# Altium schematic sheet 485Driver_MAX3462.SchDoc
size A4
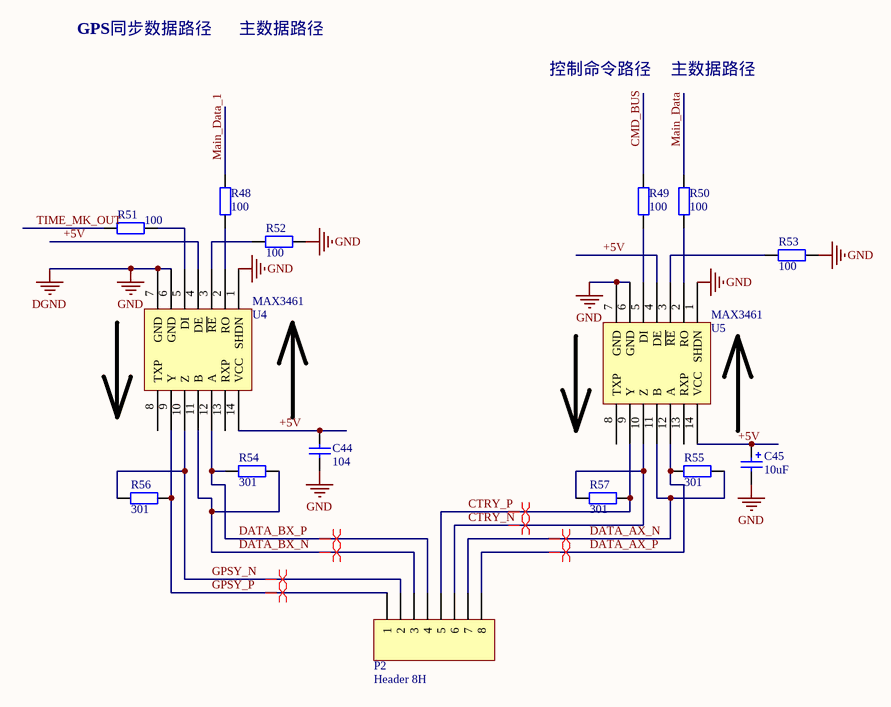
[diagram p0: 485Driver_MAX3462.SchDoc]

## Parts
C44  104  [0805C]
C45  10uF  [C68uF]
P2  Header 8H  [HDR1X8H]
R48  100  [0805R]
R49  100  [0805R]
R50  100  [0805R]
R51  100  [0805R]
R52  100  [0805R]
R53  100  [0805R]
R54  301  [0805R]
R55  301  [0805R]
R56  301  [0805R]
R57  301  [0805R]
U4  MAX3461  [SOP14]
U5  MAX3461  [SOP14]

## Nets
DGND: C44.1 C45.2 R52.2 R53.2 U4.1(SHDN) U4.6(GND) U4.7(GND) U5.1(SHDN) U5.6(GND) U5.7(GND)  [also labelled GND]
+5V: C44.2 C45.1 U4.4(DE) U4.14(VCC) U5.4(DE) U5.14(VCC)
CMD_BUS: R49.1
CTRY_N: P2.6 R57.2 U5.10(Z)
CTRY_P: P2.5 R57.1 U5.9(Y)
DATA_AX_N: P2.7 R55.1 U5.11(B)
DATA_AX_P: P2.8 R55.2 U5.12(A)
DATA_BX_N: P2.3 R54.1 U4.11(B)
DATA_BX_P: P2.4 R54.2 U4.12(A)
GPSY_N: P2.2 R56.2 U4.10(Z)
GPSY_P: P2.1 R56.1 U4.9(Y)
Main_Data: R50.1
Main_Data_1: R48.1
TIME_MK_OUT: R51.2
NetR48_2: R48.2 U4.2(RO)
NetR49_2: R49.2 U5.5(DI)
NetR50_2: R50.2 U5.2(RO)
NetR51_1: R51.1 U4.5(DI)
NetR52_1: R52.1 U4.3(~{RE})
NetR53_1: R53.1 U5.3(~{RE})

Not connected (* = marked no-connect by the designer): U4 8(TXP) 13(RXP); U5 8(TXP) 13(RXP)

## Layout directives
differential pair: CTRY_N, CTRY_P, DATA_AX_N, DATA_AX_P, DATA_BX_N, DATA_BX_P, GPSY_N, GPSY_P

## Notes on the sheet
- GPS同步数据路径
- 主数据路径
- 控制命令路径

## Library data of the parts
C44 = Cap: Capacitor; Value: 100nF; Published: 8-Jun-2000; LatestRevisionDate: 17-Jul-2002; LatestRevisionNote: Re-released for DXP Platform.; PackageReference: RAD-0.3; Publisher: Altium Limited
C45 = Cap Pol2: Polarized Capacitor (Axial); Value: 100pF; Published: 8-Jun-2000; LatestRevisionDate: 17-Jul-2002; LatestRevisionNote: Re-released for DXP Platform.; PackageReference: POLAR0.8; Publisher: Altium Limited
P2 = Header 8H: Header, 8-Pin, Right Angle; LatestRevisionDate: 17-Jul-2002; LatestRevisionNote: Re-released for DXP Platform.; Publisher: Altium Limited
R48-R57 = Res2: Resistor; Value: 1K; Published: 8-Jun-2000; LatestRevisionDate: 17-Jul-2002; LatestRevisionNote: Re-released for DXP Platform.; PackageReference: AXIAL-0.4; Publisher: Altium Limited